# EasyEDA Pro project ProDocument_backend_V0.5_2024-01-22.epro

# Schematic backend_3

## Sheets
1 P1: Create Date: 2023-09-21; Page Name: P1; Project Name: esp-alarm-clock; Schematic Name: backend_3; Update Date: 2023-10-11; Company: Taipan labs; Drawed: Kanen6174; Page Size: A4; Part Number: EC-B01; Reviewed: Kanken6174; Version: V0.8
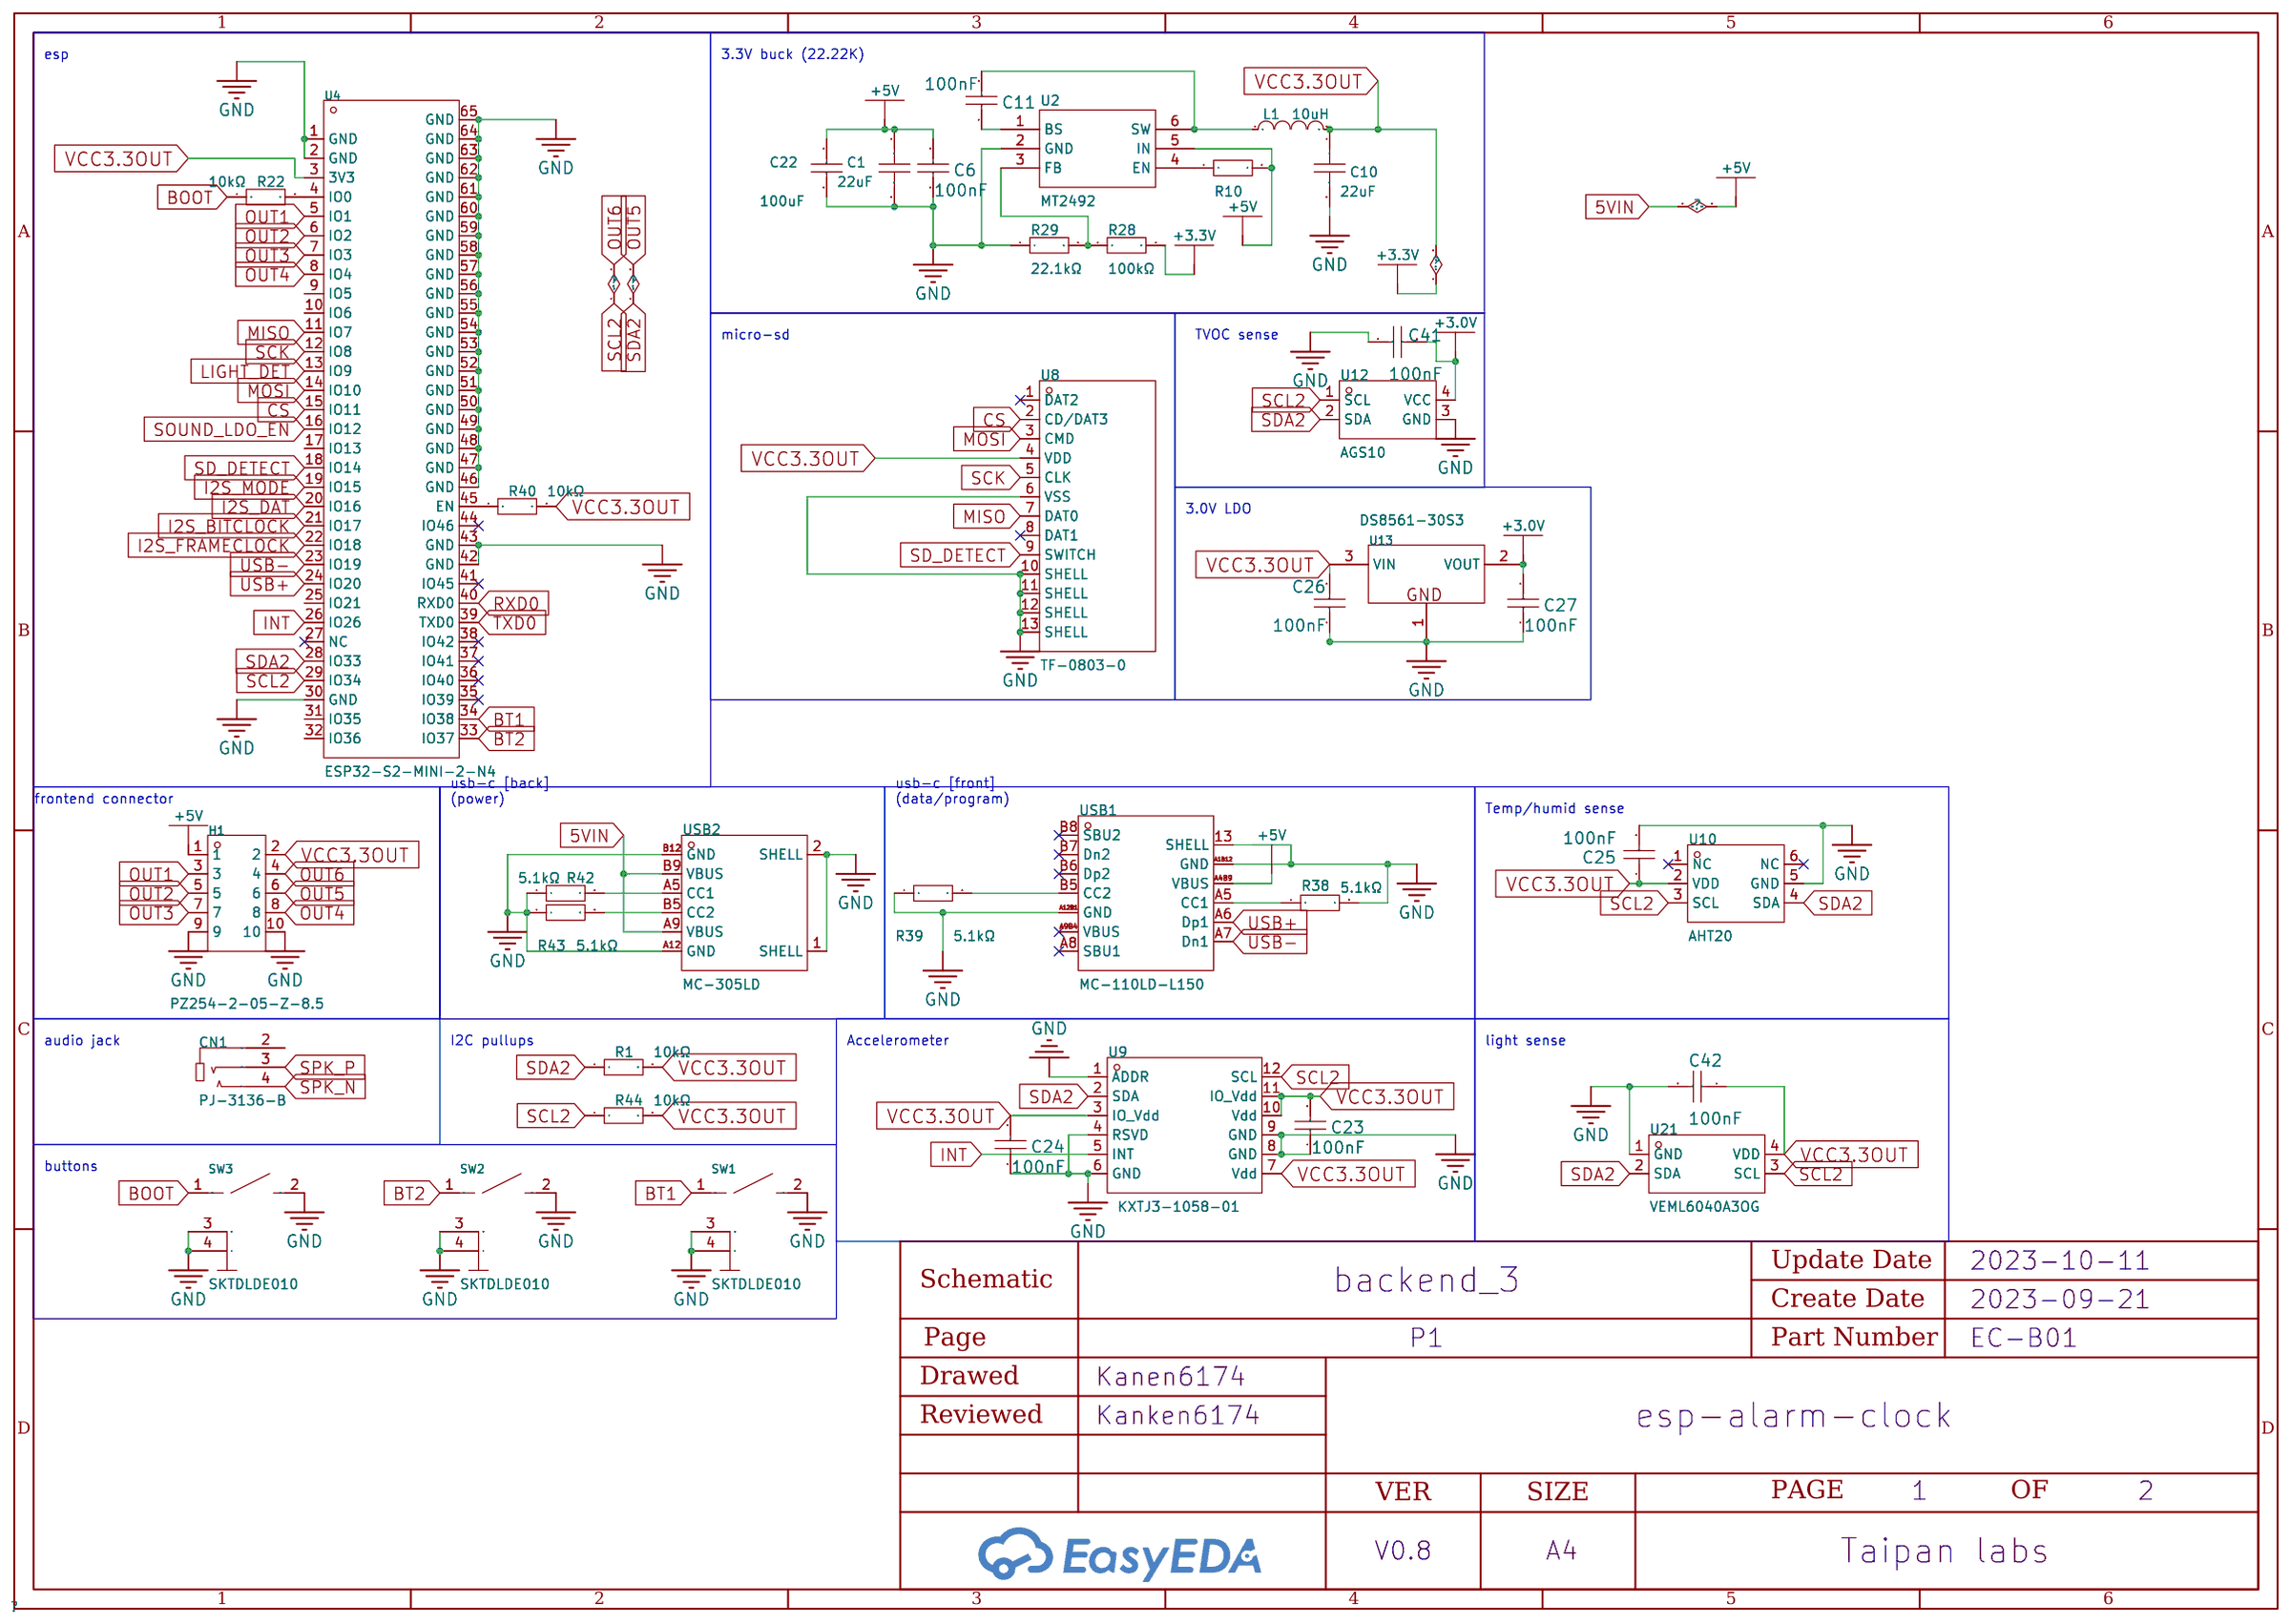
[diagram p0: P1]
2 P2: Page Name: P2; Update Date: 2023-09-21; Company: EasyEDA.com; Drawed: EasyEDA Pro; Part Number: JLCPCB-002; Reviewed: EasyEDA Pro; Version: V0.1
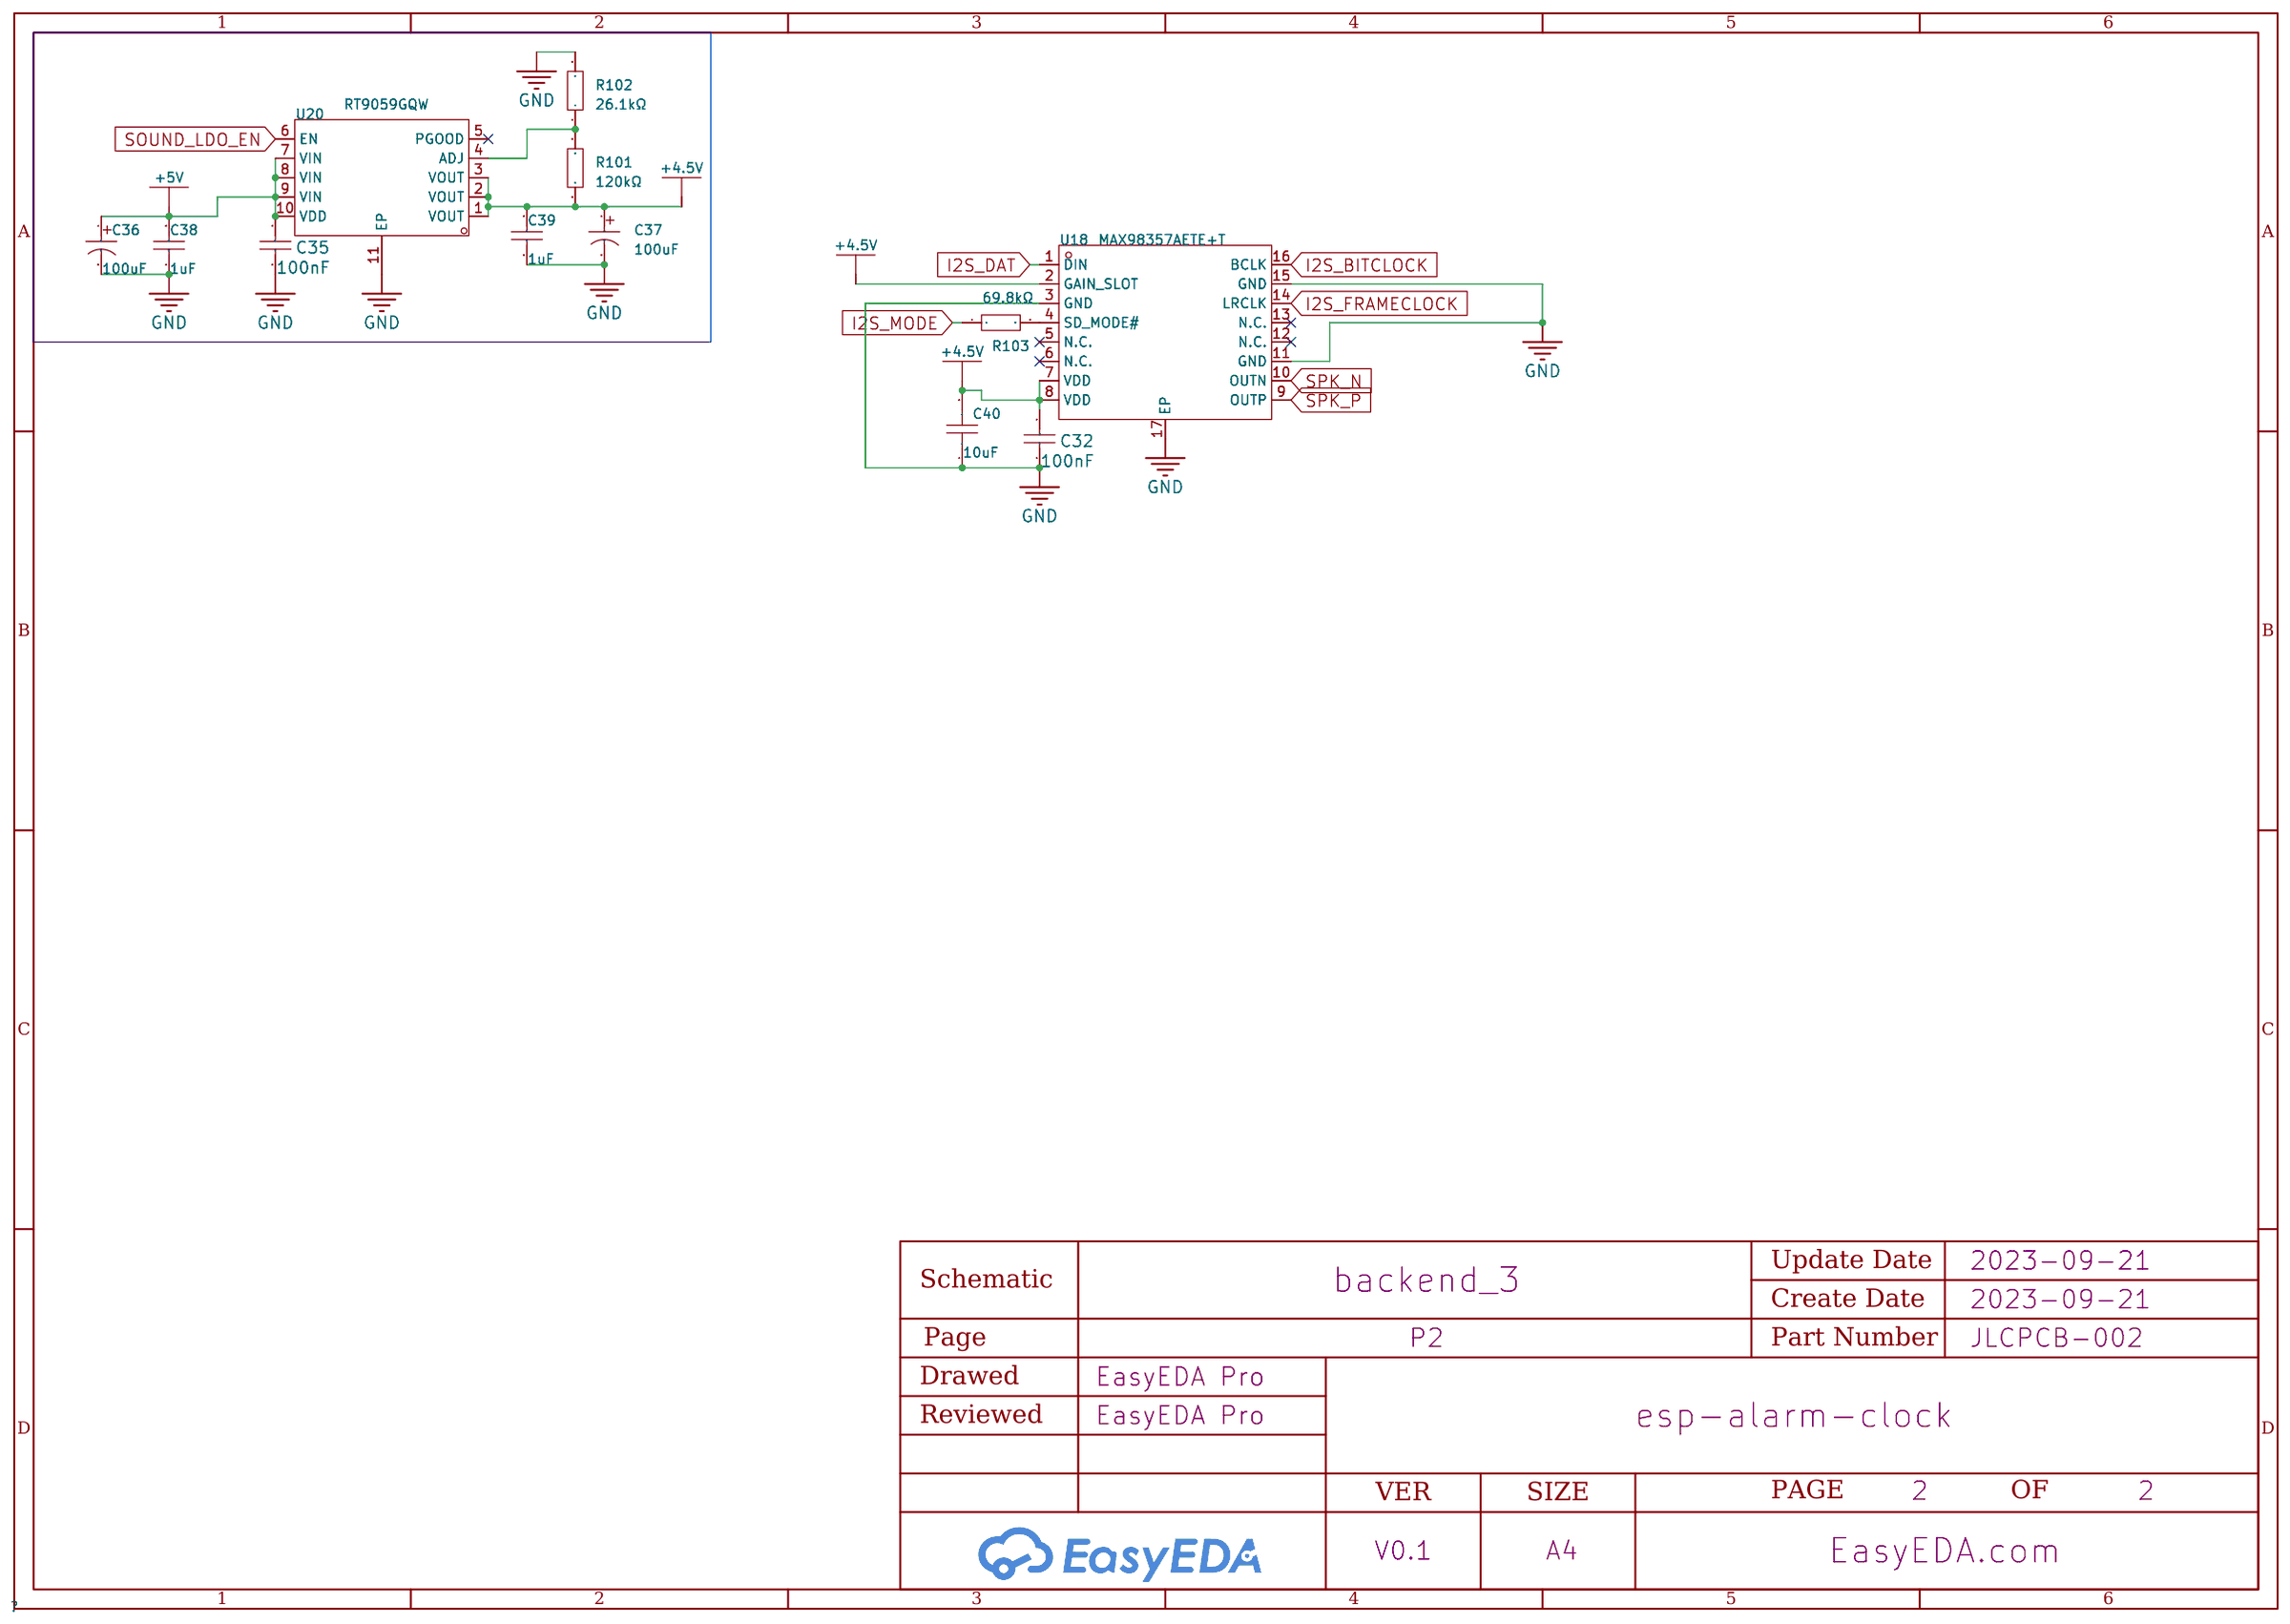
[diagram p1: P2]

## Parts
sheet P1
C1  22uF  [C0805]
C6  100nF  [C0603]
C10  22uF  [C0805]
C11  100nF  [C0603]
C22  100uF  [C1206]
C23  100nF  [C0603]
C24  100nF  [C0603]
C25  100nF  [C0603]
C26  100nF  [C0603]
C27  100nF  [C0603]
C41  100nF  [C0603]
C42  100nF  [C0603]
CN1  PJ-3136-B  [AUDIO-TH_PJ-3136-B]
H1  PZ254-2-05-Z-8.5  [HDR-TH_10P-P2.54-V-M-R2-C5-S2.54]
L1  10uH  [IND-SMD_L7.3-W6.8]
R1  10kΩ  [R0603]
R10  0603WAJ0301T5E  [R0603]
R22  10kΩ  [R0603]
R28  100kΩ  [R0603]
R29  22.1kΩ  [R0603]
R38  5.1kΩ  [R0603]
R39  5.1kΩ  [R0603]
R40  10kΩ  [R0603]
R42  5.1kΩ  [R0603]
R43  5.1kΩ  [R0603]
R44  10kΩ  [R0603]
SW1  SKTDLDE010  [KEY-SMD_SKTDLDE010]
SW2  SKTDLDE010  [KEY-SMD_SKTDLDE010]
SW3  SKTDLDE010  [KEY-SMD_SKTDLDE010]
U2  MT2492  [SOT-23-6_L2.9-W1.6-P0.95-LS2.8-BL]
U4  ESP32-S2-MINI-2-N4  [WIFI-SMD_ESP32-MINI-1-N4]
U8  TF-0803-0  [TF-SMD_XKTF-0803-0]
U9  KXTJ3-1058-01  [LGA-12_L2.0-W2.0-P0.50-BL]
U10  AHT20  [SENSOR-SMD_L3.0-W3.0-P1.00-BR]
U12  AGS10  [SENSOR-SMD_AGS10]
U13  DS8561-30S3  [SOT-23-3_L2.9-W1.6-P1.90-LS2.8-BR]
U21  VEML6040A3OG  [SENSOR_SMD_VEML6040A3OG]
USB1  MC-110LD-L150  [USB-C-TH_G-SWITCH_GT-USB-7038X]
USB2  MC-305LD  [USB-C-TH_MC-305LD]
sheet P2
C32  100nF  [C0603]
C35  100nF  [C0603]
C36  100uF  [CAP-SMD_BD6.3-L6.6-W6.6-FD]
C37  100uF  [CAP-SMD_BD6.3-L6.6-W6.6-FD]
C38  1uF  [C0603]
C39  1uF  [C0603]
C40  10uF  [C0603]
R101  120kΩ  [R0603]
R102  26.1kΩ  [R0603]
R103  69.8kΩ  [R0603]
U18  MAX98357AETE+T  [TQFN-16_L3.0-W3.0-P0.50-BL-EP1.5]
U20  RT9059GQW  [WDFN-10_L3.0-W3.0-P0.50-BL-EP]

## Library data of the parts
C1 C10 = CL21A226MAYNNNE: Capacitance: Tolerance:±20% Tolerance:±20% Voltage Rated: Temperature Coefficient:; LCSC Part Name: 22uF ±20% 25V; Supplier Part: C602037; Manufacturer: SAMSUNG(三星); Supplier Footprint: 0805; JLCPCB Part Class: Extended Part; Datasheet: https://atta.szlcsc.com/upload/public/pdf/source/20200609/C602037_1A0D619693E608A1BF6E80154254E2DB.pdf; Supplier: LCSC; Tolerance: ±20%
C6 C11 C23-C27 C32 C35 C41 C42 = 0603B104K250CT: Supplier: LCSC; Manufacturer: Walsin(华新科); Supplier Part: C83054; JLCPCB Part Class: Extended Part
C22 = CL31A107MQHNNNE: Capacitance: Tolerance:±20% Tolerance:±20% Voltage Rated: Temperature Coefficient:; LCSC Part Name: 100uF ±20% 6.3V; Supplier Part: C15008; Manufacturer: SAMSUNG(三星); Supplier Footprint: 1206; JLCPCB Part Class: Basic Part; Datasheet: https://atta.szlcsc.com/upload/public/pdf/source/20160103/1457707673200.pdf; Supplier: LCSC; Tolerance: ±20%
CN1 = PJ-3136-B: Connector Type:3.5mm耳机座 Current Rating (Max):0.5A Voltage Rating (Max):30V Contact Material:- Contact Plating:- Operating Temperature Range:-20℃~+70℃ Operating Temperature Range:-20℃~+70℃ Welding Temperature (Max):235℃; LCSC Part Name: 3.5mm耳机座 6P; Supplier Part: C381131; Manufacturer: XKB Connectivity(中国星坤); Supplier Footprint: 插件; JLCPCB Part Class: Extended Part; Datasheet: https://atta.szlcsc.com/upload/public/pdf/source/20211011/336996E57D1E1BCFE5E9A3862F8E1528.pdf; Supplier: LCSC; Connector Type: 3.5mm耳机座; Current Rating (Max): 0.5A; Voltage Rating (Max): 30V; Operating Temperature Range: -20℃~+70℃; Welding Temperature (Max): 235℃
H1 = PZ254-2-05-Z-8.5_C2894966: Number of Rows:双排 Number of Pins:10 Pitch:2.54mm Pin Structure:2x5P Row Spacing:2.54mm Mounting Type:Straight Circluar Pins/Square Pins:Square Pins Current Rating (Max):3A Voltage Rating (Max):- Length of Mating Pin:6mm Insulation Height:2.5mm Length of E; LCSC Part Name: 2.54mm 2x5P 直插 方针; Supplier Part: C2894966; Manufacturer: HCTL(华灿天禄); Supplier Footprint: 直插,P=2.54mm; JLCPCB Part Class: Extended Part; Supplier: LCSC; Number of Rows: 双排; Number of Pins: 10; Pitch: 2.54mm; Pin Structure: 2x5P; Row Spacing: 2.54mm; Mounting Type: Straight; Circluar Pins/Square Pins: Square Pins; Current Rating (Max): 3A; Length of Mating Pin: 6mm; Insulation Height: 2.5mm; Length of End Connection Pin: 3mm; Operating Temperature Range: -40℃~+105℃; Color: Black
L1 = FXL0630-100-M: Inductance: Tolerance:±20% Tolerance:±20% Rated Current: Saturation Current (Isat):5.5A DC Resistance (DCR): Ratings:-; LCSC Part Name: 10uH ±20% 4.5A 62mΩ; Supplier Part: C167223; Manufacturer: cjiang(长江微电); Supplier Footprint: SMD,6.6x7mm; JLCPCB Part Class: Extended Part; Datasheet: https://atta.szlcsc.com/upload/public/pdf/source/20190322/C167223_8858C3FC3676E2A39A1CDEAF2C3E5524.pdf; Supplier: LCSC; Tolerance: ±20%; Saturation Current (Isat): 5.5A
R1 R22 R40 R44 = RC0603FR-0710KL: Type:Thick Film Resistors Resistance: Tolerance:±1% Tolerance:±1% Power(Watts): Temperature Coefficient:±100ppm/℃ Temperature Coefficient:±100ppm/℃ Overload Voltage (Max): Operating Temperature Range:-55℃~+155℃ Operating Temperature Range:-55℃~+155℃; LCSC Part Name: 10kΩ ±1% 100mW; Supplier Part: C98220; Manufacturer: YAGEO(国巨); Supplier Footprint: 0603; JLCPCB Part Class: Extended Part; Datasheet: https://atta.szlcsc.com/upload/public/pdf/source/20170522/1495423494387.pdf; Supplier: LCSC; Type: Thick Film Resistors; Tolerance: ±1%; Temperature Coefficient: ±100ppm/℃; Operating Temperature Range: -55℃~+155℃
R10 = 0603WAJ0301T5E: LCSC Part Name: 300Ω(301) ±5% 编带; Supplier Part: C25229; Manufacturer: UNI-ROYAL(厚声); Supplier Footprint: 0603; JLCPCB Part Class: Extended Part; Datasheet: https://atta.szlcsc.com/upload/public/pdf/source/20170920/C25229_1505901277001982855.pdf; Supplier: LCSC
R28 = 0603WAF1003T5E: Type:Thick Film Resistors Resistance: Tolerance:±1% Tolerance:±1% Power(Watts): Temperature Coefficient:±100ppm/℃ Temperature Coefficient:±100ppm/℃ Overload Voltage (Max): Operating Temperature Range:-55℃~+155℃ Operating Temperature Range:-55℃~+155℃; LCSC Part Name: 100kΩ ±1% 100mW; Supplier Part: C25803; Manufacturer: UNI-ROYAL(厚声); Supplier Footprint: 0603; JLCPCB Part Class: Basic Part; Datasheet: https://atta.szlcsc.com/upload/public/pdf/source/20200306/C422600_1E6D84923E4A46A82E41ADD87F860B5C.pdf; Supplier: LCSC; Type: Thick Film Resistors; Tolerance: ±1%; Temperature Coefficient: ±100ppm/℃; Operating Temperature Range: -55℃~+155℃
R29 = 0603WAF2212T5E: Type:Thick Film Resistors Resistance: Tolerance:±1% Tolerance:±1% Power(Watts): Temperature Coefficient:±100ppm/℃ Temperature Coefficient:±100ppm/℃ Overload Voltage (Max): Operating Temperature Range:-55℃~+155℃ Operating Temperature Range:-55℃~+155℃; LCSC Part Name: 22.1kΩ ±1% 100mW; Supplier Part: C25961; Manufacturer: UNI-ROYAL(厚声); Supplier Footprint: 0603; JLCPCB Part Class: Extended Part; Datasheet: https://atta.szlcsc.com/upload/public/pdf/source/20200306/C422600_1E6D84923E4A46A82E41ADD87F860B5C.pdf; Supplier: LCSC; Type: Thick Film Resistors; Tolerance: ±1%; Temperature Coefficient: ±100ppm/℃; Operating Temperature Range: -55℃~+155℃
R38 R39 R42 R43 = 0603WAJ0512T5E: Type:Thick Film Resistors Resistance: Tolerance:±5% Tolerance:±5% Power(Watts): Temperature Coefficient:±100ppm/℃ Temperature Coefficient:±100ppm/℃ Overload Voltage (Max): Operating Temperature Range:-55℃~+155℃ Operating Temperature Range:-55℃~+155℃; LCSC Part Name: 5.1kΩ ±5% 100mW; Supplier Part: C26000; Manufacturer: UNI-ROYAL(厚声); Supplier Footprint: 0603; JLCPCB Part Class: Extended Part; Datasheet: https://atta.szlcsc.com/upload/public/pdf/source/20200306/C422600_1E6D84923E4A46A82E41ADD87F860B5C.pdf; Supplier: LCSC; Type: Thick Film Resistors; Tolerance: ±5%; Temperature Coefficient: ±100ppm/℃; Operating Temperature Range: -55℃~+155℃
SW1-SW3 = SKTDLDE010: Contact Current:50mA Voltage Rating (DC):12V Circuit:SPST Mounting Style:Lying Actuator Style:Rectangle button With Lamp:- Mechanical Life:- Switch Length:3.9mm Switch Width:2.9mm Switch Height:1.55mm; LCSC Part Name: 3.9*2.9*1.55mm 卧插 轻触开关; Supplier Part: C115365; Manufacturer: ALPSALPINE(阿尔卑斯阿尔派); Supplier Footprint: 插件; JLCPCB Part Class: Extended Part; Datasheet: https://atta.szlcsc.com/upload/public/pdf/source/20170620/1497944818446.pdf; Supplier: LCSC; Contact Current: 50mA; Voltage Rating (DC): 12V; Circuit: SPST; Mounting Style: Lying; Actuator Style: Rectangle button; Switch Length: 3.9mm; Switch Width: 2.9mm; Switch Height: 1.55mm
U2 = MT2492: Function:Step-down type Synchronous Rectification:- Number of Outputs:- Topology:- Input Voltage:- Input Voltage:- Output Current (Max):- Switching Frequency:-; LCSC Part Name: 降压型; Supplier Part: C89358; Manufacturer: 西安航天民芯; Supplier Footprint: SOT-23-6; JLCPCB Part Class: Extended Part; Datasheet: https://atta.szlcsc.com/upload/public/pdf/source/20221209/5C81DA9662873D3A116170FFBF63E49D.pdf; Supplier: LCSC; Function: Step-down type
U4 = ESP32-S2-MINI-2-N4: Supplier Part: C3013906; Manufacturer: ESPRESSIF(乐鑫); Supplier Footprint: SMD; JLCPCB Part Class: Extended Part; Datasheet: https://atta.szlcsc.com/upload/public/pdf/source/20220815/99ECD7479F9259A66C7C6E1140388E9F.pdf; Supplier: LCSC
U8 = TF-0803-0: Connector Type:Deck; LCSC Part Name: 卡座; Supplier Part: C5362199; Manufacturer: HanElectricity(瀚源); Supplier Footprint: SMD; Datasheet: https://atta.szlcsc.com/upload/public/pdf/source/20230308/B70A5967A4B676EB8AFEDB5CDBD33107.pdf; Supplier: LCSC; Connector Type: Deck
U9 = KXTJ3-1058-01: Supplier Part: C308623; Manufacturer: ROHM(罗姆); Supplier Footprint: LGA-12(2x2); JLCPCB Part Class: Extended Part; Datasheet: https://atta.szlcsc.com/upload/public/pdf/source/20190522/C308623_3C6E8D9D4902E242F51FA6C25311530C.pdf; Supplier: LCSC
U10 = AHT20: Supplier Part: C2757850; Manufacturer: 广州奥松; Supplier Footprint: SMD; JLCPCB Part Class: Extended Part; Datasheet: https://atta.szlcsc.com/upload/public/pdf/source/20200407/C503357_487829B2F97386053400E2E73B0ABB4D.pdf; Supplier: LCSC
U12 = AGS10: LCSC Part Name: I2C接口的集成式 VOC 传感器; Supplier Part: C3012632; Manufacturer: 广州奥松; Supplier Footprint: SMD-4P,4x5mm; JLCPCB Part Class: Extended Part; Datasheet: https://atta.szlcsc.com/upload/public/pdf/source/20220513/6A4D32DA204F561428CB46BB650E28D4.pdf; Supplier: LCSC
U13 = DS8561-30S3: Supplier Part: C5795632; Manufacturer: DSTECH(奥简科技); Supplier Footprint: SOT23-3; Supplier: LCSC
U21 = VEML6040A3OG: Supply Voltage:2.5V~3.6V Supply Voltage:2.5V~3.6V Quiescent Current (Iq):- Interface Type:I2C Resolution:- Detection color:Red,Green,Blue,White Operating Temperature:-40℃~+85℃ Operating Temperature:-40℃~+85℃; Supplier Part: C78465; Manufacturer: VISHAY(威世); Supplier Footprint: OPLGA-4(1.3x2); JLCPCB Part Class: Extended Part; Datasheet: https://atta.szlcsc.com/upload/public/pdf/source/20180511/C78465_1ECCD5CBB0DFD90660DF8047804D95FA.pdf; Supplier: LCSC; Supply Voltage: 2.5V~3.6V; Interface Type: I2C; Detection color: Red,Green,Blue,White; Operating Temperature: -40℃~+85℃
USB1 = MC-110LD-L150: Connector Type:Type-C Standard:USB 3.1 Gender:Female Number of Contacts:16P Number of Ports:1 Mounting Style:Straight Current Rating - Power (Max):5A Contact Material:- Contact Plating:- Operating Temperature Range:-40℃~+85℃ Operating Temperature Range:-4; LCSC Part Name: Type-C 母座 直插; Supplier Part: C3039284; Manufacturer: HANBO(汉博); Supplier Footprint: 插件; JLCPCB Part Class: Extended Part; Datasheet: https://atta.szlcsc.com/upload/public/pdf/source/20230324/59444C5E453B645FEF886B7F168F8320.pdf; Supplier: LCSC; Connector Type: Type-C; Standard: USB 3.1; Gender: Female; Number of Contacts: 16P; Number of Ports: 1; Mounting Style: Straight; Current Rating - Power (Max): 5A; Operating Temperature Range: -40℃~+85℃
USB2 = MC-305LD: Supplier Part: C2874578; Manufacturer: HANBO(汉博); Supplier Footprint: SMD; JLCPCB Part Class: Extended Part; Supplier: LCSC
C36 C37 = UWX1C101MCL1GB: Capacitance: Tolerance:±20% Tolerance:±20% Rated Voltage: φD: L: Ripple Current:129mA@10kHz Equivalent Series Resistance(ESR):- Lifetime @ Temp:2000hrs@85℃ Operating Temperature:-40℃~+85℃ Operating Temperature:-40℃~+85℃; LCSC Part Name: 100uF ±20% 16V; Supplier Part: C111600; Manufacturer: Nichicon(尼吉康); Supplier Footprint: SMD,D6.3xL5.5mm; JLCPCB Part Class: Extended Part; Datasheet: https://atta.szlcsc.com/upload/public/pdf/source/20170511/1494500117526.pdf; Supplier: LCSC; Tolerance: ±20%; Ripple Current: 129mA@10kHz; Lifetime @ Temp: 2000hrs@85℃; Operating Temperature: -40℃~+85℃
C38 C39 = CL10A105KO8NNNC: Capacitance: Tolerance:±10% Tolerance:±10% Voltage Rated: Temperature Coefficient:; LCSC Part Name: 1uF ±10% 16V; Supplier Part: C1592; Manufacturer: SAMSUNG(三星); Supplier Footprint: 0603; JLCPCB Part Class: Extended Part; Datasheet: https://atta.szlcsc.com/upload/public/pdf/source/20220919/9FBE606BE0D9532D730F292EB26DC5BB.pdf; Supplier: LCSC; Tolerance: ±10%
C40 = CL10A106MQ8NNNC: Capacitance: Tolerance:±20% Tolerance:±20% Voltage Rated: Temperature Coefficient:; LCSC Part Name: 10uF ±20% 6.3V; Supplier Part: C1691; Manufacturer: SAMSUNG(三星); Supplier Footprint: 0603; JLCPCB Part Class: Extended Part; Datasheet: https://atta.szlcsc.com/upload/public/pdf/source/20160103/1457707690948.pdf; Supplier: LCSC; Tolerance: ±20%
R101 = 0603WAF1203T5E: Type:Thick Film Resistors Resistance: Tolerance:±1% Tolerance:±1% Power(Watts): Temperature Coefficient:±100ppm/℃ Temperature Coefficient:±100ppm/℃ Overload Voltage (Max): Operating Temperature Range:-55℃~+155℃ Operating Temperature Range:-55℃~+155℃; LCSC Part Name: 120kΩ ±1% 100mW; Supplier Part: C25808; Manufacturer: UNI-ROYAL(厚声); Supplier Footprint: 0603; JLCPCB Part Class: Basic Part; Datasheet: https://atta.szlcsc.com/upload/public/pdf/source/20200306/C422600_1E6D84923E4A46A82E41ADD87F860B5C.pdf; Supplier: LCSC; Type: Thick Film Resistors; Tolerance: ±1%; Temperature Coefficient: ±100ppm/℃; Operating Temperature Range: -55℃~+155℃
R102 = 0603WAF2612T5E: Type:Thick Film Resistors Resistance: Tolerance:±1% Tolerance:±1% Power(Watts): Temperature Coefficient:±100ppm/℃ Temperature Coefficient:±100ppm/℃ Overload Voltage (Max): Operating Temperature Range:-55℃~+155℃ Operating Temperature Range:-55℃~+155℃; LCSC Part Name: 26.1kΩ ±1% 100mW; Supplier Part: C23356; Manufacturer: UNI-ROYAL(厚声); Supplier Footprint: 0603; JLCPCB Part Class: Extended Part; Datasheet: https://atta.szlcsc.com/upload/public/pdf/source/20200306/C422600_1E6D84923E4A46A82E41ADD87F860B5C.pdf; Supplier: LCSC; Type: Thick Film Resistors; Tolerance: ±1%; Temperature Coefficient: ±100ppm/℃; Operating Temperature Range: -55℃~+155℃
R103 = 0603WAF6982T5E: Type:Thick Film Resistors Resistance: Tolerance:±1% Tolerance:±1% Power(Watts): Temperature Coefficient:±100ppm/℃ Temperature Coefficient:±100ppm/℃ Overload Voltage (Max): Operating Temperature Range:-55℃~+155℃ Operating Temperature Range:-55℃~+155℃; LCSC Part Name: 69.8kΩ ±1% 100mW; Supplier Part: C23098; Manufacturer: UNI-ROYAL(厚声); Supplier Footprint: 0603; JLCPCB Part Class: Extended Part; Datasheet: https://atta.szlcsc.com/upload/public/pdf/source/20200306/C422600_1E6D84923E4A46A82E41ADD87F860B5C.pdf; Supplier: LCSC; Type: Thick Film Resistors; Tolerance: ±1%; Temperature Coefficient: ±100ppm/℃; Operating Temperature Range: -55℃~+155℃
U18 = MAX98357AETE+T: Type of Power Amplifier: Output Power:; Supplier Part: C910544; Manufacturer: ADI(亚德诺)/MAXIM(美信); Supplier Footprint: TQFN-16-EP(3x3); JLCPCB Part Class: Extended Part; Datasheet: https://atta.szlcsc.com/upload/public/pdf/source/20210106/C910544_CB6DE4B2CEE254A72E6BDB40E718D281.pdf; Supplier: LCSC
U20 = RT9059GQW: Output Type: Output Polarity:Positive Number of Outputs:1 Maximum Input Voltage:5.5V Dropout Voltage:450mV@3A Quiescent Current (Ground Current):1.2mA Output Current:3A Power Supply Rejection Ratio (PSRR):- Noise:- Feature:过热保护,Overcurrent Protection，使能，P; Supplier Part: C147977; Manufacturer: RICHTEK(立锜); Supplier Footprint: DFN-10-EP(3x3); JLCPCB Part Class: Extended Part; Datasheet: https://atta.szlcsc.com/upload/public/pdf/source/20180126/C147977_15169561278691309265.pdf; Supplier: LCSC; Output Polarity: Positive; Number of Outputs: 1; Maximum Input Voltage: 5.5V; Dropout Voltage: 450mV@3A; Quiescent Current (Ground Current): 1.2mA; Output Current: 3A; Feature: 过热保护,Overcurrent Protection，使能，PG脚; Operating Temperature: -40℃~+125℃@(Tj)

## Nets
+3.0V: C27.2 C41.1 U12.4(VCC) U13.2(VOUT)
+3.3V: C10.1 C23.2 C24.2 C25.1 C26.2 C42.1 H1.2 L1.2 R1.2 R28.2 R40.2 R44.2 U4.3(3V3) U8.4(VDD) U9.3(IO Vdd) U9.7(Vdd) U9.10(Vdd) U9.11(IO Vdd) U10.2(VDD) U13.3(VIN) U21.4(VDD)
+4.5V: C32.2 C37.1 C39.2 C40.2 R101.1 U18.2(GAIN_SLOT) U18.7(VDD) U18.8(VDD) U20.1(VOUT) U20.2(VOUT) U20.3(VOUT)
+5V: C1.1 C6.2 C22.1 C35.2 C36.1 C38.2 H1.1 R10.2 U2.5(IN) U20.7(VIN) U20.8(VIN) U20.9(VIN) U20.10(VDD) USB1.A4B9(VBUS) USB2.A9(VBUS) USB2.B9(VBUS)
GND: C1.2 C6.1 C10.2 C22.2 C23.1 C24.1 C25.2 C26.1 C27.1 C32.1 C35.1 C36.2 C37.2 C38.1 C39.1 C40.1 C41.2 C42.2 H1.9 H1.10 R29.1 R38.2 R39.1 R42.1 R43.1 R102.2 SW1.2 SW1.3 SW1.4 SW2.2 SW2.3 SW2.4 SW3.2 SW3.3 SW3.4 U2.2(GND) U4.1(GND) U4.2(GND) U4.30(GND) U4.42(GND) U4.43(GND) U4.46(GND) U4.47(GND) U4.48(GND) U4.49(GND) U4.50(GND) U4.51(GND) U4.52(GND) U4.53(GND) U4.54(GND) U4.55(GND) U4.56(GND) U4.57(GND) U4.58(GND) U4.59(GND) U4.60(GND) U4.61(GND) U4.62(GND) U4.63(GND) U4.64(GND) U4.65(GND) U8.6(VSS) U8.10(SHELL) U8.11(SHELL) U8.12(SHELL) U8.13(SHELL) U9.1(ADDR) U9.4(RSVD) U9.6(GND) U9.8(GND) U9.9(GND) U10.5(GND) U12.3(GND) U13.1(GND) U18.3(GND) U18.11(GND) U18.15(GND) U18.17(EP) U20.11(EP) U21.1(GND) USB1.13(SHELL) USB1.A1B12(GND) USB1.A12B1(GND) USB2.1(SHELL) USB2.2(SHELL) USB2.A12(GND) USB2.B12(GND)
BOOT: R22.1 SW3.1
BT1: SW1.1 U4.34(IO38)
BT2: SW2.1 U4.33(IO37)
CS: U4.15(IO11) U8.2(CD/DAT3)
I2S_BITCLOCK: U4.21(IO17) U18.16(BCLK)
I2S_DAT: U4.20(IO16) U18.1(DIN)
I2S_FRAMECLOCK: U4.22(IO18) U18.14(LRCLK)
I2S_MODE: R103.1 U4.19(IO15)
INT: U4.26(IO26) U9.5(INT)
LIGHT_DET: U4.13(IO9)
MISO: U4.11(IO7) U8.7(DAT0)
MOSI: U4.14(IO10) U8.3(CMD)
OUT1: H1.3 U4.5(IO1)
OUT2: H1.5 U4.6(IO2)
OUT3: H1.7 U4.7(IO3)
OUT4: H1.8 U4.8(IO4)
OUT5: H1.6 R1.1 U4.28(IO33) U9.2(SDA) U10.4(SDA) U12.2(SDA) U21.2(SDA)
OUT6: H1.4 R44.1 U4.29(IO34) U9.12(SCL) U10.3(SCL) U12.1(SCL) U21.3(SCL)
RXD0: U4.40(RXD0)
SCK: U4.12(IO8) U8.5(CLK)
SD_DETECT: U4.18(IO14) U8.9(SWITCH)
SOUND_LDO_EN: U4.16(IO12) U20.6(EN)
SPK_N: CN1.4 U18.10(OUTN)
SPK_P: CN1.3 U18.9(OUTP)
TXD0: U4.39(TXD0)
USB+: U4.24(IO20) USB1.A6(Dp1)
USB-: U4.23(IO19) USB1.A7(Dn1)
$1N1918: R10.1 U2.4(EN)
$1N1921: C11.1 U2.1(BS)
$1N1922: C11.2 L1.1 U2.6(SW)
$1N1926: R28.1 R29.2 U2.3(FB)
$1N4497: R39.2 USB1.B5(CC2)
$1N4508: R38.1 USB1.A5(CC1)
$1N7093: R22.2 U4.4(IO0)
$1N7254: R40.1 U4.45(EN)
$1N8846: R43.2 USB2.B5(CC2)
$1N8849: R42.2 USB2.A5(CC1)
$2N308: R101.2 R102.1 U20.4(ADJ)
$2N1521: R103.2 U18.4(SD_MODE#)

Not connected (* = marked no-connect by the designer): CN1 2; U4 9(IO5) 10(IO6) 17(IO13) 25(IO21) 27(NC)* 31(IO35) 32(IO36) 35(IO39)* 36(IO40)* 37(IO41)* 38(IO42)* 41(IO45)* 44(IO46)*; U8 1(DAT2)* 8(DAT1)*; U10 1(NC)* 6(NC)*; U18 5(N.C.)* 6(N.C.)* 12(N.C.)* 13(N.C.)*; U20 5(PGOOD)*; USB1 A8(SBU1)* A9B4(VBUS)* B6(Dp2)* B7(Dn2)* B8(SBU2)*

## Notes on the sheets
sheet 1
- esp
- 3.3V buck (22.22K)
- micro-sd
- TVOC sense
- 3.0V LDO
- frontend connector
- usb-c [back]
  (power)
- usb-c [front]
  (data/program)
- Temp/humid sense
- audio jack
- I2C pullups
- Accelerometer
- light sense
- buttons

# Board PCB1_4
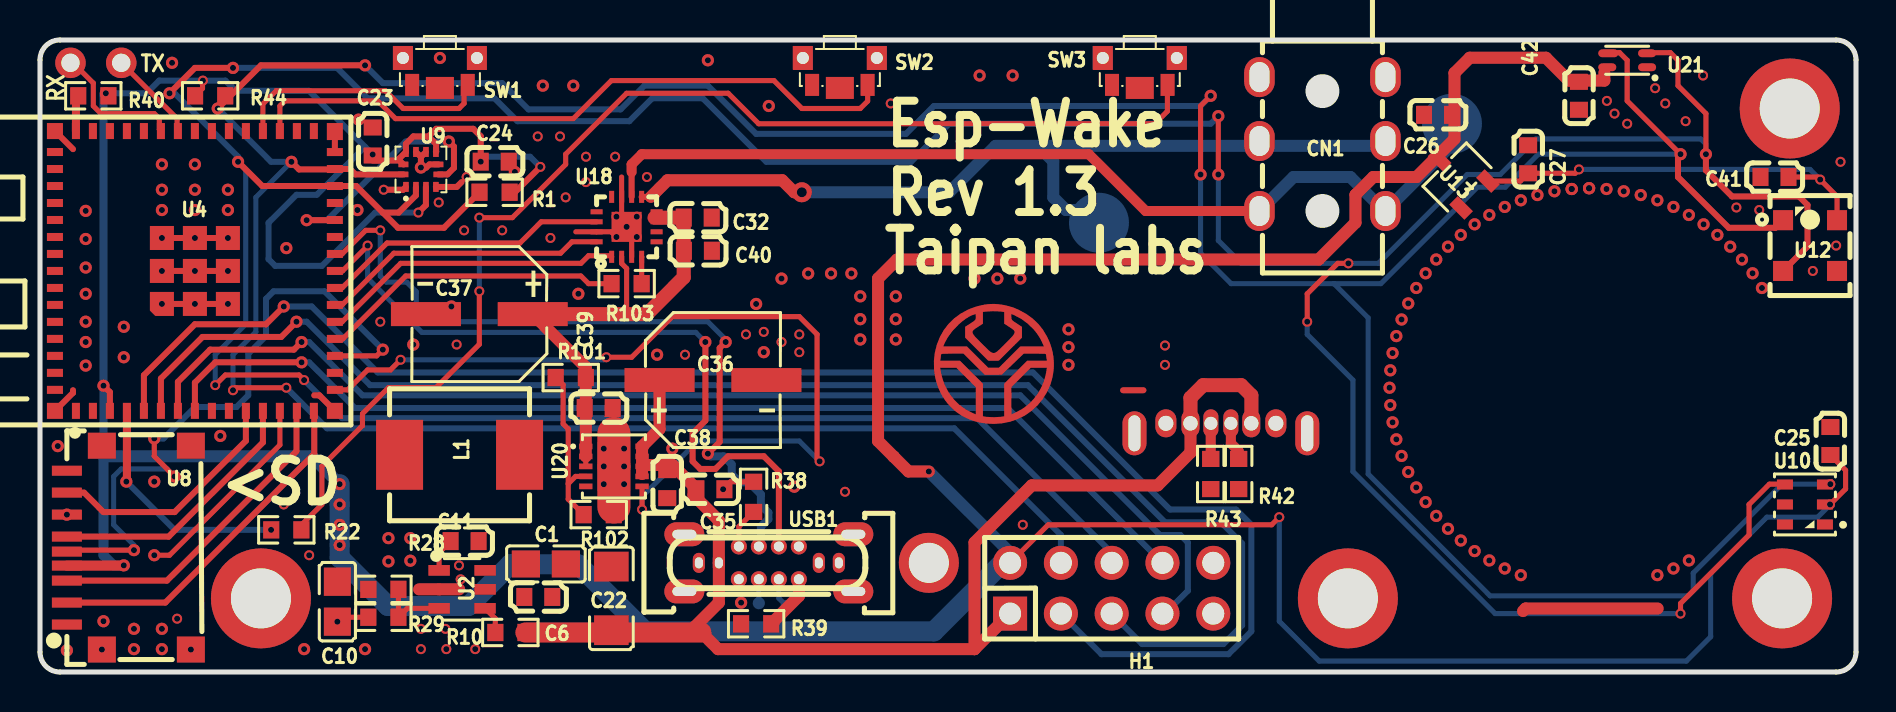
[diagram p2: board, top side]
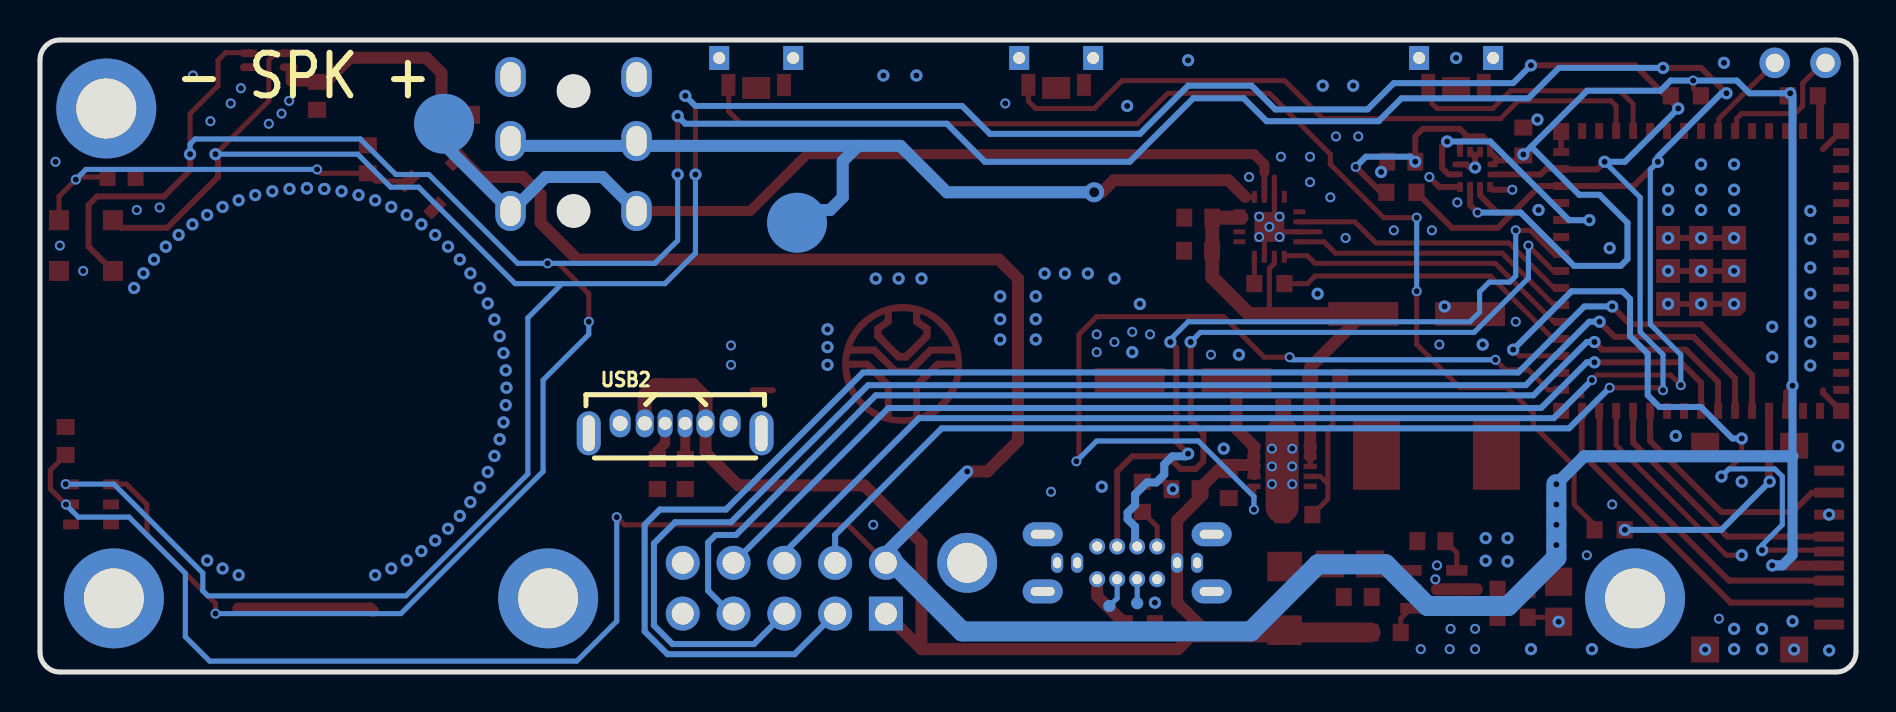
[diagram p3: board, bottom side, seen from below]

Outline 90.82 x 31.62 mm; copper layers: Top Layer, Bottom Layer. Coordinates in mm from the lower left corner of the outline.
Outline path: 0,30.62 0,1 arc(0.29,0.29) 1,0 89.82,0 arc(90.53,0.29) 90.82,1 90.82,30.62 arc(90.53,31.33) 89.82,31.62 1,31.62 arc(0.29,31.33) 0,30.62
Stack: Top Layer 0.035mm / Dielectric1 1.51mm FR4 er 4.5 / Bottom Layer 0.035mm

## Design rules (mm)
net USB+: DP1
net USB-: DP1
template: Custom Config
spacing copperThickness1oz (default): track to track 0.102, other pairs 0.152 to 0.3
spacing copperThickness2oz: track to track 0.203, other pairs 0.152 to 0.3
track width copperThickness1oz (default): min 0.127, default 0.254, max 2.54
track width copperThickness2oz: min 0.203, default 0.254, max 2.54
differential pair differentialPair (default): width min 0.127, default 0.254, max 2.54; gap min 0.152, default 0.152
via viaSize (default): diameter min 0.5, default 0.61, max 10; hole min 0.3, default 0.305, max 6.3
net +3.3V uses big
net $1N1922 uses big
net +5V uses big

## Placement (name value [footprint] x y rotation side)
C1  22uF  [C0805]  25.3 5.41 0 top
C6  100nF  [C0603]  24.92 3.76 180 top
C10  22uF  [C0805]  14.87 3.52 270 top
C11  100nF  [C0603]  21.24 6.55 0 top
C22  100uF  [C1206]  28.57 3.69 90 top
C23  100nF  [C0603]  16.64 26.55 270 top
C24  100nF  [C0603]  22.74 25.54 180 top
C25  100nF  [C0603]  89.53 11.56 90 top
C26  100nF  [C0603]  69.91 27.88 0 top
C27  100nF  [C0603]  74.42 25.66 270 top
C32  100nF  [C0603]  32.89 22.73 180 top
C35  100nF  [C0603]  33.53 9.15 180 top
C36  100uF  [CAP-SMD_BD6.3-L6.6-W6.6-FD]  33.66 14.61 0 top
C37  100uF  [CAP-SMD_BD6.3-L6.6-W6.6-FD]  21.97 17.91 180 top
C38  1uF  [C0603]  31.37 9.4 90 top
C39  1uF  [C0603]  27.94 13.21 180 top
C40  10uF  [C0603]  32.9 21.08 180 top
C41  100nF  [C0603]  86.74 24.77 180 top
C42  100nF  [C0603]  76.96 28.83 270 top
CN1  PJ-3136-B  [AUDIO-TH_PJ-3136-B]  64.13 26.42 270 top
H1  PZ254-2-05-Z-8.5  [HDR-TH_10P-P2.54-V-M-R2-C5-S2.54]  53.59 4.19 0 top
L1  10uH  [IND-SMD_L7.3-W6.8]  20.98 10.87 180 top
NOREF  -  [Pad_e3496]  11.05 3.69 0 top
NOREF#2  -  [Pad_e2134]  65.41 3.69 0 top
NOREF#3  -  [Pad_e5589]  1.52 30.48 0 top
NOREF#4  -  [Pad_e5590]  4.06 30.48 0 top
NOREF#5  -  [Pad_e2602]  70.61 27.43 90 top
NOREF#6  -  [Pad_e2132]  87.5 28.2 0 top
NOREF#7  -  [Pad_e2541]  52.96 22.48 0 top
NOREF#8  -  [Pad_e2485]  44.45 5.46 0 top
NOREF#9  -  [Pad_e5797]  37.34 3.3 0 top
NOREF#10  -  [Pad_e2025]  42.69 10.78 0 top
NOREF#11  -  [Pad_e2131]  87.12 3.69 0 top
NOREF#12  -  [Pad_e5796]  35.95 3.45 0 top
R1  10kΩ  [R0603]  22.73 24 0 top
R10  0603WAJ0301T5E  [R0603]  23.52 1.98 0 top
R22  10kΩ  [R0603]  12.32 7.11 180 top
R28  100kΩ  [R0603]  17.17 4.14 180 top
R29  22.1kΩ  [R0603]  17.17 2.74 0 top
R38  5.1kΩ  [R0603]  35.69 8.77 90 top
R39  5.1kΩ  [R0603]  35.81 2.41 0 top
R40  10kΩ  [R0603]  2.67 28.83 0 top
R42  5.1kΩ  [R0603]  59.94 9.91 90 top
R43  5.1kΩ  [R0603]  58.55 9.91 90 top
R44  10kΩ  [R0603]  8.51 28.83 180 top
R101  120kΩ  [R0603]  26.54 14.73 180 top
R102  26.1kΩ  [R0603]  27.94 7.88 0 top
R103  69.8kΩ  [R0603]  29.34 19.43 0 top
SW1  SKTDLDE010  [KEY-SMD_SKTDLDE010]  20 29.97 0 top
SW2  SKTDLDE010  [KEY-SMD_SKTDLDE010]  40 29.97 0 top
SW3  SKTDLDE010  [KEY-SMD_SKTDLDE010]  55 29.97 0 top
U2  MT2492  [SOT-23-6_L2.9-W1.6-P0.95-LS2.8-BL]  21.11 4.14 270 top
U4  ESP32-S2-MINI-2-N4  [WIFI-SMD_ESP32-MINI-1-N4]  7.75 20.07 90 top
U8  TF-0803-0  [TF-SMD_XKTF-0803-0]  4.44 6.22 270 top
U9  KXTJ3-1058-01  [LGA-12_L2.0-W2.0-P0.50-BL]  19.05 25.15 0 top
U10  AHT20  [SENSOR-SMD_L3.0-W3.0-P1.00-BR]  88.26 8.38 0 top
U12  AGS10  [SENSOR-SMD_AGS10]  88.52 21.34 270 top
U13  DS8561-30S3  [SOT-23-3_L2.9-W1.6-P1.90-LS2.8-BR]  70.87 24.77 315 top
U18  MAX98357AETE+T  [TQFN-16_L3.0-W3.0-P0.50-BL-EP1.5]  29.34 22.27 0 top
U20  RT9059GQW  [WDFN-10_L3.0-W3.0-P0.50-BL-EP]  28.7 10.29 270 top
U21  VEML6040A3OG  [SENSOR_SMD_VEML6040A3OG]  79.38 30.61 270 top
USB1  MC-110LD-L150  [USB-C-TH_G-SWITCH_GT-USB-7038X]  36.45 5.46 270 top
USB2  MC-305LD  [USB-C-TH_MC-305LD]  59.06 12.19 180 bottom

## Footprints (pads in the part's own frame, mm; a bottom-side part is the same pattern mirrored in y, then rotated)
AUDIO-TH_PJ-3136-B
  oval 2x1.524 hole 1.5x1: 2(-3.35,3.15) 2(-3.35,-3.15) 3(-0.15,3.15) 3(-0.15,-3.15) 4(3.35,3.15) 4(3.35,-3.15)
C0603
  rect 0.8x0.9 smd: 1(-0.7,0) 2(0.7,0)
C0805
  rect 1.41x1.35 smd: 1(-1,0) 2(1,0)
C1206
  rect 1.485x1.728 smd: 1(-1.593,0) 2(1.593,0)
CAP-SMD_BD6.3-L6.6-W6.6-FD
  rect 3.5x1.2 smd: 1(-2.67,0) 2(2.67,0)
HDR-TH_10P-P2.54-V-M-R2-C5-S2.54
  rect 1.7x1.7 hole 1.1: 1(-5.08,-1.27)
  round 1.7 hole 1.1: 2(-5.08,1.27) 3(-2.54,-1.27) 4(-2.54,1.27) 5(0,-1.27) 6(0,1.27) 7(2.54,-1.27) 8(2.54,1.27) 9(5.08,-1.27) 10(5.08,1.27)
IND-SMD_L7.3-W6.8
  rect 2.35x3.5 smd: 1(-3,0) 2(3,0)
KEY-SMD_SKTDLDE010
  rect 0.7x1.1 smd: 1(1.391,-0.597) 2(-1.388,-0.597)
  rect 1.4x1.1 smd: 3(0,-0.75)
  rect 1x1.2 hole 0.6: 4(-1.85,0.75) 4(1.85,0.75)
LGA-12_L2.0-W2.0-P0.50-BL
  rect 0.28x0.5 smd: 1(-0.75,-0.875) 2(-0.25,-0.875) 3(0.25,-0.875) 4(0.75,-0.875) 7(0.75,0.875) 8(0.25,0.875) 9(-0.25,0.875) 10(-0.75,0.875)
  rect 0.5x0.28 smd: 5(0.875,-0.25) 6(0.875,0.25) 11(-0.875,0.25) 12(-0.875,-0.25)
Pad_e2025
  round 0.61 smd: TP5(0,0)
Pad_e2131
  round 5 hole 3: 1(0,0)
Pad_e2132
  round 5 hole 3: 1(0,0)
Pad_e2134
  round 5 hole 3: 1(0,0)
Pad_e2485
  round 3 hole 2: 1(0,0)
Pad_e2541
  round 3 smd far side: 1(0,0)
Pad_e2602
  round 3 smd far side: 1(0,0)
Pad_e3496
  round 5 hole 3: 1(0,0)
Pad_e5589
  round 1.524 hole 0.914: 1(0,0)
Pad_e5590
  round 1.524 hole 0.914: 2(0,0)
Pad_e5796
  round 0.61 smd far side: TP10(0,0)
Pad_e5797
  round 0.61 smd far side: TP11(0,0)
R0603
  rect 0.806x0.864 smd: 1(-0.753,0) 2(0.753,0)
SENSOR-SMD_AGS10
  rect 1x1 smd: 1(-1.27,-1.35) 2(1.27,-1.35) 3(1.27,1.35) 4(-1.27,1.35)
SENSOR-SMD_L3.0-W3.0-P1.00-BR
  rect 0.8x0.5 smd: 1(1,-1) 2(1,0) 3(1,1) 4(-1,1) 5(-1,0) 6(-1,-1)
SENSOR_SMD_VEML6040A3OG
  oval 0.392x0.9 smd: 1(0.35,0.996) 2(-0.35,0.996) 4(0.35,-0.996)
  oval 0.392x1 smd: 3(-0.35,-0.946)
SOT-23-3_L2.9-W1.6-P1.90-LS2.8-BR
  rect 1.07x0.6 smd: 1(1.235,-0.95) 2(1.235,0.95) 3(-1.235,0)
SOT-23-6_L2.9-W1.6-P0.95-LS2.8-BL
  rect 0.532x1.072 smd: 1(-0.95,-1.149) 2(0,-1.149) 3(0.95,-1.149) 4(0.95,1.149) 5(0,1.149) 6(-0.95,1.149)
TF-SMD_XKTF-0803-0
  rect 0.5x1.5 smd: 1(3.85,-3.1) 2(2.75,-3.1) 3(1.65,-3.1) 4(0.9,-3.1) 5(-0.55,-3.1) 6(-1.65,-3.1) 7(-2.75,-3.1) 8(-3.85,-3.1) 9(0.2,-3.1)
  rect 1.3x1.4 smd: 10(-5.1,-1.35) 11(-5.1,3.1) 12(5.1,3.1) 13(5.1,-1.35)
TQFN-16_L3.0-W3.0-P0.50-BL-EP1.5
  rect 0.25x0.6 smd: 1(-0.749,-1.5) 2(-0.248,-1.5) 3(0.252,-1.5) 4(0.751,-1.5) 9(0.75,1.5) 10(0.25,1.5) 11(-0.25,1.5) 12(-0.749,1.5)
  rect 0.6x0.25 smd: 5(1.5,-0.748) 6(1.5,-0.248) 7(1.5,0.252) 8(1.5,0.752) 13(-1.5,0.752) 14(-1.5,0.252) 15(-1.5,-0.248) 16(-1.5,-0.748)
  rect 1.5x1.5 smd: 17(0,0)
USB-C-TH_G-SWITCH_GT-USB-7038X
  oval 1.2x2 hole 0.45x1.2: 13(-1.43,4.225) 13(-1.43,-4.225) 13(1.43,4.225) 13(1.43,-4.225)
  oval 1x0.6 hole 0.55x0.4: A1B12(0,-3.5) A4B9(0,-2.5) A9B4(0,2.5) A12B1(0,3.5)
  round 0.8 hole 0.5: A5(-0.82,-1.5) A6(-0.82,-0.5) A7(-0.82,0.5) A8(-0.82,1.5) B5(0.82,1.5) B6(0.82,0.5) B7(0.82,-0.5) B8(0.82,-1.5)
USB-C-TH_MC-305LD
  oval 1.2x2.2 hole 0.6x1.8: 1(-4.32,-0.25) 2(4.32,-0.25)
  oval 0.75x1.4 hole 0.65: A5(-0.5,0.25) B5(0.5,0.25)
  oval 0.9x1.4 hole 0.72: A9(1.52,0.25) B9(-1.52,0.25)
  oval 1.05x1.4 hole 0.75: A12(2.75,0.25) B12(-2.75,0.25)
WDFN-10_L3.0-W3.0-P0.50-BL-EP
  rect 0.28x0.665 smd: 1(-1,-1.407) 2(-0.5,-1.407) 3(0,-1.407) 4(0.5,-1.407) 5(1,-1.407) 6(1,1.407) 7(0.5,1.407) 8(0,1.407) 9(-0.5,1.407) 10(-1,1.407)
  rect 2.475x1.625 smd: 11(0,0)
WIFI-SMD_ESP32-MINI-1-N4
  rect 0.8x0.4 smd: 1(-7,5.95) 2(-7,5.1) 3(-7,4.25) 4(-7,3.4) 5(-7,2.55) 6(-7,1.7) 7(-7,0.85) 8(-7,0.001) 9(-7,-0.85) 10(-7,-1.7) 11(-7,-2.55) 12(-7,-3.4) 13(-7,-4.25) 14(-7,-5.1) 15(-7,-5.949) 31(7,-5.95) 32(7,-5.1) 33(7,-4.25) 34(7,-3.4) 35(7,-2.55) 36(7,-1.7) 37(7,-0.85) 38(7,-0.001) 39(7,0.85) 40(7,1.7) 41(7,2.55) 42(7,3.4) 43(7,4.25) 44(7,5.1) 45(7,5.949)
  rect 0.4x0.8 smd: 16(-5.95,-7) 17(-5.1,-7) 18(-4.25,-7) 19(-3.4,-7) 20(-2.55,-7) 21(-1.7,-7) 22(-0.85,-7) 23(-0.001,-7) 24(0.85,-7) 25(1.7,-7) 26(2.55,-7) 27(3.4,-7) 28(4.25,-7) 29(5.1,-7) 30(5.949,-7) 46(5.95,7) 47(5.1,7) 48(4.25,7) 49(3.4,7) 50(2.55,7) 51(1.7,7) 52(0.85,7) 53(0,7) 54(-0.85,7) 55(-1.7,7) 56(-2.55,7) 57(-3.4,7) 58(-4.25,7) 59(-5.1,7) 60(-5.95,7)
  custom 1.2x1.2 smd: 61(-1.65,1.65)
  rect 1.2x1.2 smd: 61(-1.65,0) 61(-1.65,-1.65) 61(0,1.65) 61(0,0) 61(0,-1.65) 61(1.649,-1.65) 61(1.65,1.65) 61(1.65,0)
  rect 0.8x0.8 smd: 62(-7,7) 63(-7,-7) 65(7,7)
  rect 0.85x0.8 smd: 64(6.975,-7)

## Nets
As in the schematic, except:
+3.3V: C10.1 C23.2 C24.2 C25.1 C26.2 C42.1 H1.2 L1.2 NOREF#10.TP5 R1.2 R28.2 R40.2 R44.2 U4.3 U8.4 U9.3 U9.7 U9.10 U9.11 U10.2 U13.3 U21.4
GND: C1.2 C6.1 C10.2 C22.2 C23.1 C24.1 C25.2 C26.1 C27.1 C32.1 C35.1 C36.2 C37.2 C38.1 C39.1 C40.1 C41.2 C42.2 H1.9 H1.10 NOREF.1 NOREF#2.1 NOREF#6.1 NOREF#8.1 NOREF#11.1 R29.1 R38.2 R39.1 R42.1 R43.1 R102.2 SW1.2 SW1.3 SW1.4 SW2.2 SW2.3 SW2.4 SW3.2 SW3.3 SW3.4 U2.2 U4.1 U4.2 U4.30 U4.42 U4.43 U4.46 U4.47 U4.48 U4.49 U4.50 U4.51 U4.52 U4.53 U4.54 U4.55 U4.56 U4.57 U4.58 U4.59 U4.60 U4.61 U4.62 U4.63 U4.64 U4.65 U8.6 U8.10 U8.11 U8.12 U8.13 U9.1 U9.4 U9.6 U9.8 U9.9 U10.5 U12.3 U13.1 U18.3 U18.11 U18.15 U18.17 U20.11 U21.1 USB1.13 USB1.A1B12 USB1.A12B1 USB2.1 USB2.2 USB2.A12 USB2.B12
RXD0: NOREF#3.1 U4.40
SPK_N: CN1.4 NOREF#5.1 U18.10
SPK_P: CN1.3 NOREF#7.1 U18.9
TXD0: NOREF#4.2 U4.39

Pads without a net: CN1 2; NOREF#9 TP11; NOREF#12 TP10; U4 9 10 17 25 27 31 32 35 36 37 38 41 44; U8 1 8; U10 1 6; U18 5 6 12 13; U20 5; USB1 A8 A9B4 B6 B7 B8

## Via types
v1: diameter 0.61, hole 0.305, Top Layer to Bottom Layer, 171 vias
v2: diameter 0.5, hole 0.305, Top Layer to Bottom Layer, 83 vias
v3: diameter 1, hole 0.5, Top Layer to Bottom Layer, 1 via

## Routing (per net, layer and track width the routed paths; a pad name or vN(x,y) marks a point on that pad's centre or on a via; arc(x,y) is an arc through that point)
+3.0V: length 21.1
  Top Layer w0.254: U12.4 89.87,23.8 v2(89.03,24.64) 88.9,24.77 C41.1 ; v2(76.96,25.15) 76.77,24.96 C27.2 74.03,24.57 U13.2
  Bottom Layer w0.254: v2(89.03,24.64) 88.52,25.15 v2(76.96,25.15)
+3.3V: length 250
  Top Layer w0.254: H1.2 50.42,7.37 61.59,7.37 v2(61.98,7.75) ; R44.2 8.13,29.2 8.13,29.59 ; C25.1 90.3,10.1 90.3,9.16 v2(89.52,8.38)
  Top Layer w0.3: R1.2 23.75,24 v2(25.02,25.27) ; v2(18.92,22.99) 19.3,23.37 U9.3 ; 16.64,25.59 17.98,25.59 ; 17.98,25.59 U9.11 ; 17.98,25.59 17.98,25.7 U9.10 18.3,26.43 18.67,26.8 19.43,26.8 ; v1(22.04,25.54) 22.04,26.81 21.67,27.18 19.81,27.18 19.43,26.8 ; v1(3.17,14.33) 3.5,14 U4.3 ; 19.43,26.8 19.81,26.42 19.81,26.03 U9.7
  Top Layer w0.5: v1(4.19,5.34) 4.18,5.32 U8.4
  Top Layer w0.6: 78.23,29.97 78.23,29.59 76.45,29.59 75.31,30.74 71.5,30.74 70.74,29.97 70.74,26.67 68.83,24.77 66.68,24.77 65.79,23.88 65.79,22.48 63.95,20.64 42.86,20.64 41.91,19.69 41.91,11.56 NOREF#10.TP5 43.43,10.03 v2(44.45,10.03)
  Bottom Layer w0.254: v2(61.98,7.75) 61.98,2.54 63.97,0.55 82.33,0.55 83.55,1.76 83.55,4.94 86.36,7.75 88.9,7.75 89.53,8.38
  Bottom Layer w0.3: 16.25,26.28 13.84,23.88 12.83,23.88 11.43,22.48 11.43,20.66 11.77,20.32 14.1,20.32 16.76,22.99 v2(18.92,22.99) ; 16.25,26.28 13.45,29.08 9.78,29.08 9.27,29.59 v2(8.15,29.59) 5.96,29.59 5.33,28.96 v1(3.29,28.96) ; 16.25,26.28 v1(16.64,25.89) ; v2(25.02,25.27) 24.51,25.78 22.29,25.78 v1(22.04,25.54)
  Bottom Layer w0.4: 3.17,10.8 v1(3.17,14.33) 3.17,28.84 v1(3.29,28.96)
  Bottom Layer w0.5: 3.17,10.8 3.17,5.84 3.68,5.34 v1(4.19,5.34)
  Bottom Layer w0.6: 3.17,10.8 13.59,10.8 v1(14.99,9.4) ; v2(44.45,10.03) 48.51,5.97 H1.2
  Bottom Layer w1: H1.2 48.13,5.46 44.7,2.03 30.26,2.03 26.91,5.39 23.52,5.39 21.43,3.3 17.4,3.3 14.99,5.72 v1(14.99,6.35) v1(14.99,7.37) v1(14.99,8.38) v1(14.99,9.4)
+4.5V: length 24.5
  Top Layer w0.254: U18.2 29.09,20.44 29.34,20.19 29.34,18.02 29.23,17.91 ; U20.2 U20.3
  Top Layer w0.6: C37.1 27.29,15.26 U20.1 U20.2
  Top Layer w0.7: 30.73,22.73 C32.2 32.19,19.75 30.35,17.91 C37.1
+5V: length 67.6
  Top Layer w0.6: USB2.A9 57.53,10.98 55.89,9.34 49.6,9.34 46.74,6.48 46.74,1.14 ; U20.8 U20.9 U20.10 30.99,12.16 C36.1 ; U20.8 30.18,10.36 31.63,10.36 32.68,9.31 32.68,8.85 33.95,7.58 USB1.A4B9 33.95,3.47 32.77,2.29 33.91,1.14 46.74,1.14 ; U20.8 30.11,9.91 ; 46.74,1.14 H1.1
  Top Layer w0.7: USB2.B9 60.58,12.45 60.58,13.84 60.07,14.35 58.17,14.35 57.53,13.72 USB2.A9
  Top Layer w1: 33.08,1.98 R10.2
GND: length 42.6
  Top Layer w0.254: v1(14.87,2.52) 15.09,2.74 R29.1 ; 26.8,22.03 28.57,22.03 v2(28.83,21.77) ; U18.3 29.59,22.02 v2(29.34,22.27) 29.09,22.53 U18.11 29.09,24.77 ; R38.2 34.54,9.52 v1(34.16,9.15)
  Top Layer w0.3: v1(9.4,21.72) v1(7.75,21.72) 6.1,21.72 ; 19.05,25.77 U9.8 ; 19.05,25.77 U9.9 ; 19.05,25.77 v1(19.05,25.24) 19.32,25.24 19.47,25.4 U9.6 ; v1(9.4,18.42) v1(7.75,18.42) v1(6.1,18.42) ; 17.4,24.13 18.16,24.13 U9.1 ; v1(6.1,20.07) v1(7.75,20.07) v1(9.4,20.07) ; 13.72,13.84 13.97,13.84 U4.63 ; U4.65 1.65,26.16 ; 21.08,24.51 20.84,24.27 U9.4 ; U4.62 1.65,13.97 1.65,14.1 ; 54.17,14.1 55.18,14.1 ; U4.64 U4.30
  Top Layer w0.6: 80.9,3.18 74.29,3.18 74.17,3.05 ; 18.96,4.14 U2.2 20.96,4.14
  Top Layer w1.65: 28.7,11.94 U20.11 28.7,8.26
  vias: v1(0.89,11.3) v1(1.34,7.88) v1(1.34,1.08) v1(2.29,23.07) v1(2.29,21.67) v1(2.29,20.24) v1(2.29,18.92) v1(2.29,17.53) v1(2.29,16.51) v1(2.29,15.33) v1(3.09,1.12) v1(3.17,2.54) v1(4.19,17.27) v1(4.19,15.75) v1(4.7,2.16) v1(4.7,1.14) v1(5.72,9.53) v1(6.1,25.4) v1(6.1,24.13) v1(6.1,23.12) v1(6.1,21.72) v1(6.1,2.16) v1(6.1,1.14) v1(6.6,30.48) v1(7.55,1.12) v1(7.75,25.4) v1(7.75,24.13) v1(7.75,23.12) v1(9.02,11.81) v1(9.4,24.13) v1(9.4,23.12) v1(12.32,21.21) v1(13.21,1.14) v1(15.93,27.64) v1(15.88,23.12) v1(16.26,1.14) v1(17.43,6.7) v1(17.43,5.53) v1(18.52,6.7) v1(18.52,5.57) v1(18.67,16.38) v1(20,30.72) v1(20.57,18.29) v1(23.75,25.02) v1(25.15,29.34) v1(26.67,29.34) v1(26.92,18.92) v1(30.86,15.88) v1(31.62,11.18) v1(33.4,30.61) v1(35.06,3.47) v1(35.81,18.42) v1(36.19,16) v1(36.45,28.32) v1(37.08,19.69) v1(37.72,9.27) v1(38.42,19.94) v1(39.56,19.94) v1(40.58,19.94) v1(41.02,18.8) v1(41.02,17.66) v1(41.02,16.64) v1(42.8,18.8) v1(42.8,17.66) v1(42.8,16.64) v1(46.74,19.69) v1(46.99,29.85) v1(47.88,19.69) v1(48.64,29.85) v1(49.02,19.69) v1(51.44,17.15) v1(51.44,16.26) v1(51.44,15.37) v1(67.53,15.1) v1(67.49,14.23) v1(67.53,13.36) v1(67.64,15.96) v1(67.64,12.49) v1(67.83,16.81) v1(67.83,11.64) v1(68.09,17.64) v1(68.09,10.81) v1(68.43,18.44) v1(68.43,10.01) v1(68.83,19.22) v1(68.83,9.24) v1(69.29,19.95) v1(69.29,8.5) v1(69.82,20.64) v1(69.82,7.81) v1(70.41,21.28) v1(70.41,7.17) v1(71.06,21.87) v1(71.06,6.58) v1(71.75,22.4) v1(71.75,6.05) v1(72.48,22.87) v1(72.48,5.58) v1(73.25,23.27) v1(73.25,5.18) v1(74.06,23.6) v1(74.06,4.85) v1(74.89,23.87) v1(75.74,24.05) v1(76.6,24.17) v1(76.6,24.17) v1(77.47,24.21) v1(77.47,24.21) v1(78.34,24.17) v1(79.2,24.05) v1(80.05,23.87) v1(80.88,23.6) v1(80.88,4.85) v1(81.69,23.27) v1(81.69,5.18) v1(82.46,22.87) v1(82.46,5.58) v1(83.19,22.4) v1(83.88,21.87) v1(84.53,21.28) v1(85.12,20.64) v1(85.65,19.95) v1(86.11,19.22) v2(6.86,2.67) v2(12.19,8.38) v2(13.46,5.84) v2(17.02,17.53) v2(17.19,24.13) v2(19.05,2.16) v2(19.05,1.14) v2(19.94,23.5) v2(20.28,2.16) v2(20.32,1.14) v2(20.84,16.38) v2(20.95,5.34) v2(21.04,4.64) v2(21.21,22.1) v2(21.34,24.77) v2(21.77,1.14) v2(23.11,22.1) v2(24.89,26.8) v2(25.53,21.72) v2(26.01,26.8) v2(26.29,23.75) v2(27.31,25.78) v2(27.31,24.51) v2(28.19,11.18) v2(28.19,10.29) v2(28.19,9.4) v2(28.76,25.78) v2(28.83,22.78) v2(29.21,11.18) v2(29.21,10.29) v2(29.21,9.4) v2(29.84,22.78) v2(29.84,21.77) v2(30.35,24.77) v2(32.26,15.88) v2(35.31,16.89) v2(36.19,17.02) v2(37.08,16.51) v2(37.97,16.89) v2(37.97,16) v2(40.26,9.02) v2(42.54,28.45) v2(49.15,7.37) v2(56.26,16.34) v2(56.26,15.37) v2(78.36,28.58) v2(78.74,27.94) v2(79.38,27.43) v2(80.77,29.21) v2(81.28,28.45) v2(82.3,27.56) v2(83.17,29.85) v2(84.84,23.24) v2(85.98,23.12) v2(88.66,20.07) v2(89.82,21.34) v2(90.04,25.53)
(no net): length 2.8
  Bottom Layer w0.254: USB1.B6 36.95,3.69 NOREF#9.TP11 ; USB1.B7 35.95,3.3
BOOT: length 59.8
  Top Layer w0.254: 56.38,29 56.38,28.06 55.75,27.43 35.94,27.43 34.42,28.96 29.34,28.96 26.29,25.91 26.29,25.4 23.62,22.73 v2(21.97,22.73) ; R22.1 13.07,7.36 14.1,8.38 14.1,10.3 16.13,12.33 16.13,12.93 17.44,14.23 19.81,14.23 21.97,16.4 v2(21.97,19.05)
  Bottom Layer w0.254: v2(21.97,22.73) v2(21.97,19.05)
BT1: length 13.2
  Top Layer w0.254: SW1.1 21.21,29.2 21.21,28.45 20.95,28.2 18.16,28.2 17.27,29.08 11.81,29.08 11.15,28.42 U4.34
BT2: length 33.5
  Top Layer w0.254: U4.33 12,28.32 12.25,28.58 16.89,28.58 17.78,27.69 26.67,27.69 28.57,29.59 36.7,29.59 38.1,28.2 41.02,28.2 41.39,28.57 SW2.1
CS: length 17.6
  Top Layer w0.3: U4.15 13.72,13.05 13.72,10.92 6.27,3.47 U8.2
I2S_BITCLOCK: length 14.4
  Top Layer w0.254: U4.21 15.11,18.37 17.7,20.96 26.03,20.96 26.61,21.53 27.84,21.53
I2S_DAT: length 15.2
  Top Layer w0.254: U18.1 28.53,20.83 27.43,20.83 27.05,20.45 18.04,20.45 15.11,17.52 U4.20
I2S_FRAMECLOCK: length 14.5
  Top Layer w0.254: U4.22 15.11,19.22 17.35,21.46 24,21.46 25.07,22.53 27.84,22.53
I2S_MODE: length 15.3
  Top Layer w0.254: R103.1 27.43,19.43 27.05,19.81 18.29,19.81 15.14,16.67 U4.19
INT: length 12.5
  Top Layer w0.3: U4.26 14.74,22.61 v1(13.33,22.61) ; U9.5 20.38,24.9 20.7,25.22 20.7,26.29 v1(20.45,26.55)
  Bottom Layer w0.3: v1(13.33,22.61) 14.35,22.61 18.29,26.55 v1(20.45,26.55)
LIGHT_DET: length 10.3
  Top Layer w0.254: v1(5.72,5.84) 6.48,5.84 12,11.36 U4.13
MISO: length 12.3
  Top Layer w0.3: U8.7 2.2,8.97 3.17,8 6.73,8 10.3,11.57 U4.11
MOSI: length 16.2
  Top Layer w0.3: U4.14 12.83,13.05 12.83,11.05 6.35,4.57 U8.3
OUT1: length 79.3
  Top Layer w0.3: U4.5 5.2,14.85 7.75,17.4 11.3,17.4 v1(12.19,18.29)
  Bottom Layer w0.3: H1.3 53.09,0.89 59.44,0.89 60.58,2.03 60.58,7.37 59.82,8.13 56.51,8.13 49.66,14.99 16.89,14.99 13.59,18.29 v1(12.19,18.29)
OUT2: length 72.9
  Top Layer w0.3: U4.6 6.05,14.69 8.13,16.77 12.06,16.77 12.7,17.4
  Bottom Layer w0.3: H1.5 55.12,1.4 59.18,1.4 60.12,2.33 60.12,6.43 59.06,7.49 56.26,7.49 49.4,14.35 16.51,14.35 13.33,17.53 v1(12.83,17.53)
OUT3: length 61.1
  Top Layer w0.3: U4.7 6.9,14.52 8.51,16.13 12.7,16.13 v1(13.08,16.51)
  Bottom Layer w0.3: H1.7 56.26,2.92 57.4,4.07 57.4,6.48 57.03,6.86 56.01,6.86 49.02,13.84 16.13,13.84 13.46,16.51 v1(13.08,16.51)
OUT4: length 54.4
  Top Layer w0.3: U4.8 7.75,14.48 8.76,15.5 v1(13.08,15.5)
  Bottom Layer w0.3: v1(13.08,15.5) 13.46,15.5 15.75,13.21 48.39,13.21 H1.8
OUT5: length 232.5
  Top Layer w0.254: v2(65.43,20.45) 64.9,20.45 63.37,18.92 v2(63.37,17.53) ; U21.2 80.4,30.99 81.53,30.99 81.91,30.61 81.91,29.34 83.31,27.94 v1(83.31,25.91) ; v2(82.04,2.92) 82.04,3.43 85.47,6.86 85.47,8.38 86.49,9.4 87.5,9.4 87.52,9.38 ; v2(8.76,14.35) 9.27,14.86 12.95,14.86 v2(13.21,14.61) ; v1(58.93,27.81) v1(58.93,24.89)
  Top Layer w0.3: 17.14,22.99 15.82,24.32 U4.28 11.12,24.32 v1(9.91,25.53) ; 17.14,22.99 17.91,22.23 20.2,22.23 R1.1 ; 17.14,22.99 17.94,22.99 18.8,23.85 U9.2 ; v1(9.65,30.23) 7.75,30.23 v1(6.48,28.96) ; v1(83.31,25.91) 83.31,25.1 84.62,23.8 87.97,23.8 88.39,23.37 88.39,21.29 U12.2
  Bottom Layer w0.254: v1(58.93,24.89) 58.93,21.59 60.07,20.45 v2(65.43,20.45) 66.93,20.45 71.37,24.89 73.03,24.89 74.8,26.67 83.06,26.67 83.31,26.42 v1(83.31,25.91) ; v1(9.91,25.53) 10.29,25.15 10.29,17.4 8.76,15.88 v2(8.76,14.35) ; v2(63.37,17.53) 63.37,16.89 65.66,14.61 65.66,10.03 72.77,2.92 v2(82.04,2.92)
  Bottom Layer w0.3: v1(58.93,27.81) 58.55,27.43 45.47,27.43 43.56,25.53 36.32,25.53 33.14,28.71 30.62,28.71 29.47,27.56 23.88,27.56 22.73,28.7 16.38,28.7 14.86,30.23 v1(9.65,30.23) ; v1(9.91,25.53) 9.91,25.78 6.73,28.96 v1(6.48,28.96) ; v2(13.21,14.61) 15.11,12.7 46.86,12.7 53.59,5.97 H1.6
OUT6: length 211.6
  Top Layer w0.254: v2(12.32,14.23) 9.78,14.23 v2(9.65,14.1) ; v1(58.55,28.83) 58.04,28.32 v1(58.04,24.89) ; U21.3 78.46,30.99 78.99,30.99 79.38,30.61 79.38,28.58 v1(82.04,25.91)
  Top Layer w0.3: v1(16.26,30.35) 11.05,30.35 v1(8.89,28.2) ; v1(82.04,25.91) 81.91,25.78 81.91,24.77 84.46,22.23 86.79,22.23 U12.1 ; v1(12.57,25.53) 12.95,25.15 14.73,25.15 U4.29 15.51,25.17 15.78,24.9 U9.12
  Bottom Layer w0.254: v2(9.65,14.1) 9.65,15.88 10.8,17.02 10.8,23.75 v1(12.57,25.53) ; v1(82.04,25.91) 74.93,25.91 73.28,24.26 71.88,24.26 67.06,19.43 64.71,19.43 ; 64.71,19.43 66.42,17.72 66.42,9.91 72.52,3.81 82.42,3.81 82.68,4.07 82.68,4.95 87.12,9.4 v2(89.53,9.4) ; 64.71,19.43 59.56,19.43 58.04,20.96 v1(58.04,24.89)
  Bottom Layer w0.3: v1(8.89,28.2) 11.56,25.53 v1(12.57,25.53) ; H1.4 51.05,6.86 45.72,12.19 14.35,12.19 v2(12.32,14.23) ; v1(58.55,28.83) 58.04,28.32 44.7,28.32 43.31,26.93 35.81,26.93 33.4,29.34 30.23,29.34 29.04,28.15 24.43,28.15 23.11,29.47 17.14,29.47 v1(16.26,30.35)
RXD0: length 7.5
  Top Layer w0.254: 1.02,30.61 1.52,30.61 2.67,29.47 2.67,28.32 3.05,27.94 5.72,27.94 5.97,27.69 5.97,27.15 U4.40
SCK: length 13.3
  Top Layer w0.3: U4.12 11.15,11.49 6.44,6.77 U8.5
SD_DETECT: length 33.7
  Top Layer w0.254: U8.9 1.42,6.1 v1(4.7,6.1) ; U4.18 16.83,15.82 v1(17.14,16.13) ; v1(5.72,11.69) 5.72,10.8 v1(6.73,9.78)
  Bottom Layer w0.254: v1(4.7,6.1) 4.7,6.35 3.68,7.37 3.68,9.78 4.06,10.16 6.35,10.16 v1(6.73,9.78)
  Bottom Layer w0.3: v1(17.14,16.13) 14.22,19.05 11.68,19.05 11.3,18.67 11.3,16.81 10.42,15.92 10.42,13.85 9.83,13.26 7.75,13.26 6.18,11.69 v1(5.72,11.69)
SOUND_LDO_EN: length 44.7
  Top Layer w0.254: U20.6 v2(30.11,8.13) ; v2(28.32,15.75) 29.59,15.75 31.62,17.78 37.97,17.78 38.86,16.89 38.86,10.67 v2(38.99,10.54) ; v2(18.03,15.62) 17.53,15.11 16.38,15.11 15.39,14.12 U4.16
  Bottom Layer w0.254: v2(30.11,8.13) 30.11,8.78 32.89,11.56 37.97,11.56 v2(38.99,10.54) ; v2(28.32,15.75) 28.19,15.62 v2(18.03,15.62)
SPK_N: length 47.9
  Top Layer w0.3: 29.59,25.02 U18.10
  Top Layer w0.5: CN1.4 55.29,23.07 52.45,25.91 30.1,25.91 29.59,25.4 29.59,25.02
  Bottom Layer w0.6: NOREF#5.1 70.61,26.39 CN1.4 67.23,23.07 65.53,24.77 62.68,24.77 CN1.4
SPK_P: length 43.7
  Top Layer w0.3: U18.9 30.55,23.77
  Top Layer w0.6: v3(38.1,24) 37.72,24 37.12,24.6 31.38,24.6 30.55,23.77
  Bottom Layer w0.6: 49.9,26.33 67.18,26.33 ; 49.9,26.33 50.67,25.56 50.67,23.75 51.31,23.12 52.58,23.12 ; 49.9,26.33 47.79,26.33 45.47,24 v3(38.1,24)
TXD0: length 4.8
  Top Layer w0.254: 3.94,30.61 6.86,27.69 6.86,27.11 U4.39
USB+: length 37.1
  Top Layer w0.254: U4.24 15.11,20.92 16.29,22.1 v2(17.02,22.1)
  Top Layer w0.3: 33.4,10.93 33.99,11.51 33.99,16.21 v1(34.29,16.51)
  Bottom Layer w0.254: v1(34.29,16.51) 34.29,16.64 33.4,17.53 19.3,17.53 18.82,18.01 18.82,19.02 18.34,19.51 17.32,19.51 17.02,19.81 v2(17.02,22.1)
  Bottom Layer w0.4: v1(33.4,10.92) 33.53,10.79 34.19,10.79 34.59,10.39 34.59,9.89 34.99,9.49 35.46,9.49 36.05,8.89 36.05,8.35 36.43,7.98 36.43,7.65 36.05,7.28 36.05,6.39 35.95,6.28
USB-: length 37.1
  Top Layer w0.254: U4.23 15.13,20.07 16.38,21.32 v2(16.38,21.34)
  Top Layer w0.3: 36.95,6.28 36.95,10.04 36.19,10.8 34.42,10.8 33.78,10.16 33.02,10.16 32.64,10.54 32.64,11.94 33.27,12.57 v1(33.27,16.51)
  Bottom Layer w0.254: v1(33.27,16.51) 32.79,16.99 19.1,16.99 16.38,19.71 v2(16.38,21.34)
$1N1918: length 1.2
  Top Layer w0.254: 22.26,3.19 22.77,2.68 22.77,2.23
$1N1921: length 1.7
  Top Layer w0.254: C11.1 19.96,5.97 U2.1
$1N1926: length 3.6
  Top Layer w0.254: R28.1 R29.2 18.37,3.19 U2.3
$1N4497: length 2.8
  Top Layer w0.6: R39.2 37.95,3.8 USB1.B5
$1N4508: length 2
  Top Layer w0.254: R38.1 34.95,7.27 34.95,6.28
$1N7093: length 11.8
  Top Layer w0.4: v1(4.32,9.53) 4.35,9.56 U4.4
  Bottom Layer w0.3: v1(11.56,7.11) 6.73,7.11 v1(4.32,9.53)
$1N7254: length 1.9
  Top Layer w0.4: U4.45 1.8,28.95 1.79,28.96
$1N8846: length 1.8
  Top Layer w0.5: R43.2 58.55,12.44 USB2.B5
$1N8849: length 1.9
  Top Layer w0.5: R42.2 59.94,11.05 59.56,11.44 USB2.A5
$2N308: length 8.5
  Top Layer w0.254: 26.42,9.42 26.42,12.16 26.16,12.42 26.16,14.36 R101.2 ; 26.42,9.42 26.78,9.79 U20.4 ; 26.42,9.42 26.42,8.65 R102.1
$2N1521: length 1.3
  Top Layer w0.254: U18.4 30.09,20.77 R103.2

## Copper pours and planes (outline as drawn; the poured copper is in the pictures)
+3.3V on Top Layer: 13.97,3.69 16.87,3.69 17.17,3.99 17.17,4.55 16.38,5.34 16.38,7.37 16.89,7.88 19.18,7.88 20.19,8.89 20.19,13.25 16.93,13.25 13.97,10.29
+5V on Top Layer: 21.62,3.76 21.62,4.39 23.4,4.39 23.4,6.34 23.49,6.44 25.17,6.44 25.17,4.77 24.79,4.39 24.77,2.8 27.56,2.8 27.56,0.64 23.52,0.63 23.52,3.38 23,3.76
GND on Top Layer: -8,36.83 92.58,36.83 92.58,-1.65 -8,-1.65
GND on Top Layer: 18.95,3.63 20.47,3.63 20.73,3.88 20.73,4.39 20.47,4.65 19.33,4.65 19.2,4.77 19.2,6.93 18.82,7.31 16.92,7.31 16.79,7.19 16.79,5.41 17.29,4.91 18.56,4.91 18.56,4.02
GND on Bottom Layer: -10.03,38.99 93.98,38.99 93.98,-4.06 -10.03,-4.06
$1N1922 on Top Layer: 22.89,4.65 21.74,4.65 21.49,4.9 21.49,13.15 24.79,13.15 25.17,12.77 25.17,8.07 24.92,7.82 23.65,7.82 23.14,7.31 23.14,4.9

Small or netless copper shapes (teardrops, artwork), in the pictures only: 1 on Top Layer

## Text on the board
Bottom Silkscreen Layer: - SPK +
Top Silkscreen Layer: TX | RX | <SD | Taipan labs | Esp-Wake / Rev 1.3
